# Altium project ECE453-Base.PrjPcb
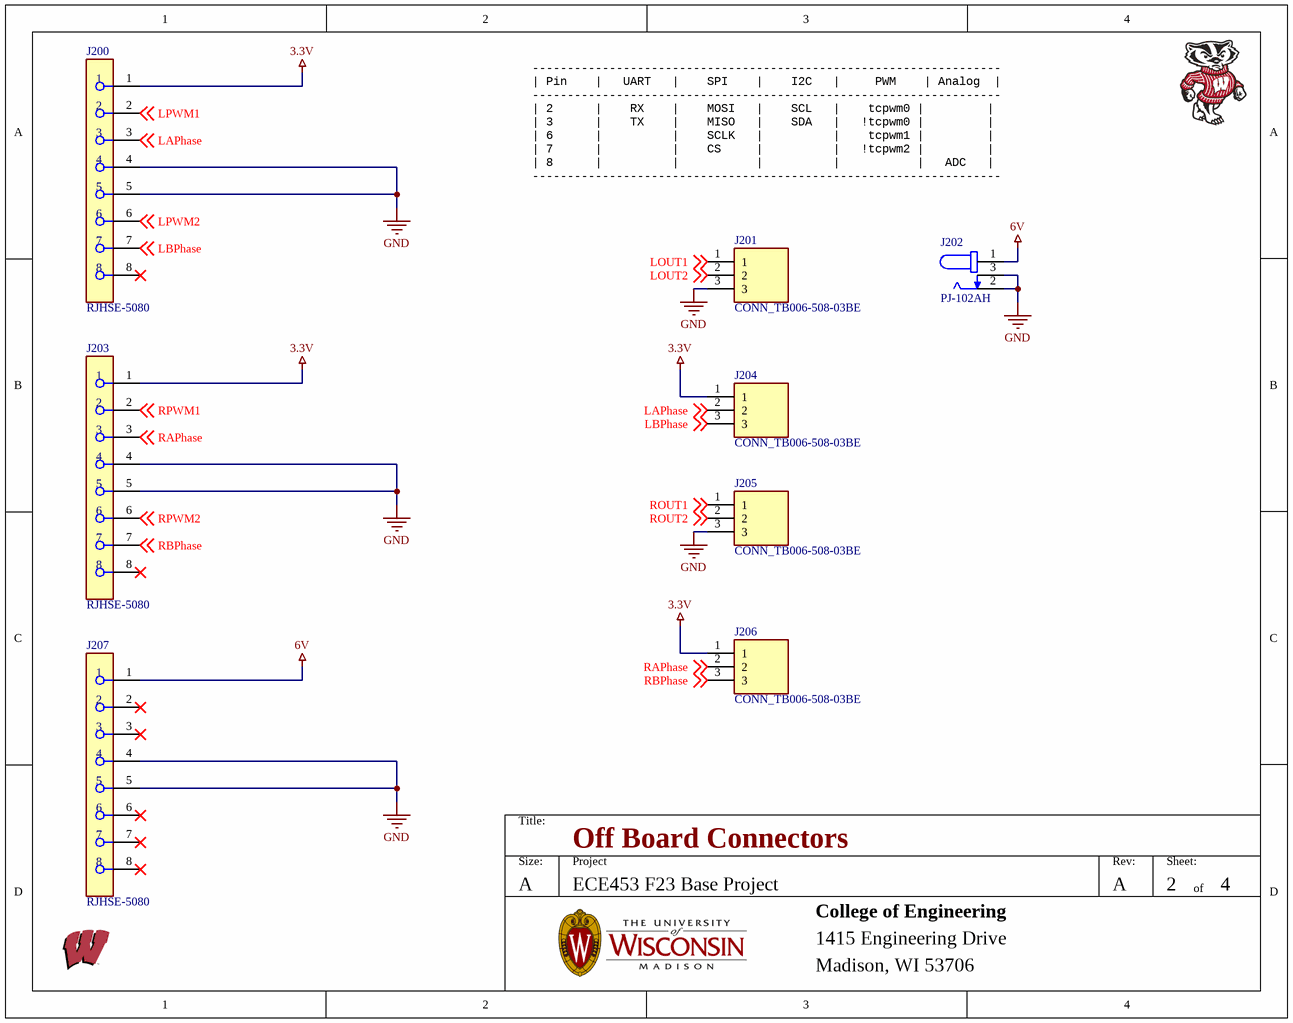
[diagram p0: 02_Connectors.SchDoc]
3 sheets, 38 parts. Net scope: global (net labels, ports and power ports of the same name join across sheets).
Board file: ECE453.PcbDoc
Sheets:
  02_Connectors.SchDoc
  03_ICs.SchDoc
  04_Mechanical.SchDoc

## Sheet 02_Connectors.SchDoc: Off Board Connectors
size A; Revision: A; SheetNumber: 2; SheetTotal: 4; ECE315_Project_Name: ECE453 F23 Base Project

### Parts
J200  RJHSE-5080  [FP-RJHSE-5080-MFG]
J201  CONN_TB006-508-03BE  [CUI_TB006-508-03BE]
J202  PJ-102AH  [CUI_PJ-102AH]
J203  RJHSE-5080  [FP-RJHSE-5080-MFG]
J204  CONN_TB006-508-03BE  [CUI_TB006-508-03BE]
J205  CONN_TB006-508-03BE  [CUI_TB006-508-03BE]
J206  CONN_TB006-508-03BE  [CUI_TB006-508-03BE]
J207  RJHSE-5080  [FP-RJHSE-5080-MFG]

### Nets
3.3V: J200.1 J203.1 J204.1 J206.1
6V: J202.1 J207.1
GND: J200.4 J200.5 J201.3 J202.2 J202.3 J203.4 J203.5 J205.3 J207.4 J207.5
LAPhase: J200.3 J204.2 ; off-sheet LAPhase
LBPhase: J200.7 J204.3 ; off-sheet LBPhase
LOUT1: J201.1 ; off-sheet LOUT1
LOUT2: J201.2 ; off-sheet LOUT2
LPWM1: J200.2 ; off-sheet LPWM1
LPWM2: J200.6 ; off-sheet LPWM2
RAPhase: J203.3 J206.2 ; off-sheet RAPhase
RBPhase: J203.7 J206.3 ; off-sheet RBPhase
ROUT1: J205.1 ; off-sheet ROUT1
ROUT2: J205.2 ; off-sheet ROUT2
RPWM1: J203.2 ; off-sheet RPWM1
RPWM2: J203.6 ; off-sheet RPWM2

Not connected (* = marked no-connect by the designer): J200 8*; J203 8*; J207 2* 3* 6* 7* 8*

### Notes on the sheet
- -------------------------------------------------------------------
  | Pin    |   UART   |    SPI    |    I2C   |     PWM    | Analog  |
  -------------------------------------------------------------------
  | 2      |    RX    |    MOSI   |    SCL   |    tcpwm0 |         |
  | 3      |    TX    |    MISO   |    SDA   |   !tcpwm0 |         |
  | 6      |          |    SCLK   |          |    tcpwm1 |         |
  | 7      |          |    CS     |          |   !tcpwm2 |         |
  | 8      |          |           |          |           |   ADC   |
  -------------------------------------------------------------------
- Title:
- Size:
- A
- Project
- Rev:
- Sheet:
- of
- College of Engineering
- 1415 Engineering Drive
- Madison, WI 53706

### Library data of the parts
J200 J203 J207 = CMP-02366-000003-1: CONN MOD JACK 8P8C R/A UNSHLD; Manufacturer: Amphenol; Current Rating: 1.5A; Voltage Rating: 125V; Pitch: 1.02mm; Conn Orientation: Right Angle; Number Of Contacts: 8; Is Female: yes; Conn Gender: Female; Lead Free: Yes; Device Class L3: unset; Footprint Url: https://cdn.amphenol-icc.com/media/wysiwyg/files/drawing/rjhse5080.pdf?__cf_chl_jschl_tk__=e349db0bbbb6188a39347cd5e541b92fa02c9719-1587748343-0-AW7tChdeHzRPLX9gSWj7WrKaXQoY9BsmT9Ek0h-T62M9y3Rs9iypFcOtkzb-6sGYQEjFE-jcoNciDETCOZrh1rYyOesac5SvYLoLwHIsHvF4AKBlx-MXmfZUVk9OTTJLqyQq2qMm0PFRLJpNcK0nrKResqOniRSYixG2sPTmOPraH-ULJFBDL602CHqcI9KKBgTq90Jh1OL2Td4moJ99rFsJRJ1Tk_uoxGe8ublcP_ARu-uLpWcQrBcwOcHDTAwL29DAwVaqcH7ta8Ks7WMlHmVl_pILeEDwT0bE9vu5Pa5S3PtNRF1leuFkgi_FMbUxTDulc5xzbXSfng8srUIV1lWXny5nx1fZJEUa_w97yKjffzBMxiWLWVN-V7-uqAaPbyv_m-wRyw5O25OZNyJOeGU; ComponentLink2URL: https://cdn.amphenol-icc.com/media/wysiwyg/files/documentation/datasheet/inputoutput/io-modjack-rjhse.pdf; Device Class L1: Connectors; Package: CONN_MOD_JACK; Mouser Description: Modular Connectors / Ethernet Connectors R/A RJ45 NONSHIELDED 8 CONT NO LEDS; Manufacturer Part Number: RJHSE-5080; Octopart: https://octopart.com/rjhse-5080-amphenol-45060; Category: Conn; Height: 0.535inch; Temperature: -55°C to +85°C; Digikey Description: CONN MOD JACK 8P8C R/A UNSHLD; Device Class L2: Modular / Ethernet Connectors; Contact Material: Gold,Nickel; ComponentLink2Description: Datasheet; Temperature Range Low: -55°C; RoHS: TRUE; Automotive: No; Temperature Range High: +85°C
J201 J204-J206 = CONN_TB006-508-03BE: 2~24 Poles, Screw Type, Horizontal, 5.08 Pitch, 26~14 (AWG), Terminal Block Connector; MF: CUI Devices; Price: None; CUI_purchase_URL: https://www.cuidevices.com/product/interconnect/connectors/terminal-blocks/tb006-508-series?utm_source=snapeda.com&utm_medium=referral&utm_campaign=snapedaBOM; Purchase-URL: https://pricing.snapeda.com/search/part/TB006-508-03BE/?ref=eda; MP: TB006-508-03BE; Value: *; Package: None; SnapEDA_Link: https://www.snapeda.com/parts/TB006-508-03BE/CUI+Devices/view-part/?ref=snap; Availability: In Stock; Check_prices: https://www.snapeda.com/parts/TB006-508-03BE/CUI+Devices/view-part/?ref=eda
J202 = CONN_PJ-102AH: 2.0 x 6.5 mm, 5.0 A, Horizontal, Through Hole, Tapered Pins, Dc Power Jack Connector; Manufacturer: CUI; MF: {'manufacturer': u'CUI Devices'}; Number of Conductors: 2; Shielding: Unshielded; Package: None; Price: None; Value: *; MP: PJ-102AH; Availability: Unavailable; Supplier: Digikey; Supplier Part Number: CP-102AH-ND; Manufacturer Part Number: PJ-102AH; RoHS: Yes; Category: Uncategorized; Stock: 76168; Pricing: 1=0.700000, 10=0.590000, 25=0.566000, 40=0.553750, 200=0.529750, 400=0.481600, 600=0.433430, 1000=0.385280, 2400=0.349160 (USD); Orientation: Horizontal; Packaging: Bulk; Termination: Through Hole; Connector Type: Jack; Diameter: 2.1mm; Lead Free: Lead Free; RoHS Compliant: Yes; ComponentLink1URL: http://www.mouser.com/ds/2/670/PJ-102AH-524179.pdf?src-supplier=Mouser; ComponentLink1Description: http://www.mouser.com/ds/2/670/PJ-102AH-524179.pdf?src-supplier=Mouser; ComponentLink2URL: https://www.cui.com/product/resource/digikeypdf/pj-102ah.pdf?src-supplier=Digikey; ComponentLink2Description: https://www.cui.com/product/resource/digikeypdf/pj-102ah.pdf?src-supplier=Digikey; ComponentLink3URL: http://www.cui.com/Product/Resource/FuturePDF/PJ-102AH.pdf?src-supplier=Future+Electronics; ComponentLink3Description: http://www.cui.com/Product/Resource/FuturePDF/PJ-102AH.pdf?src-supplier=Future+Electronics

## Sheet 03_ICs.SchDoc: ICs
size A; Revision: A; SheetNumber: 3; SheetTotal: 4; ECE315_Project_Name: ECE453 F23 Base Project
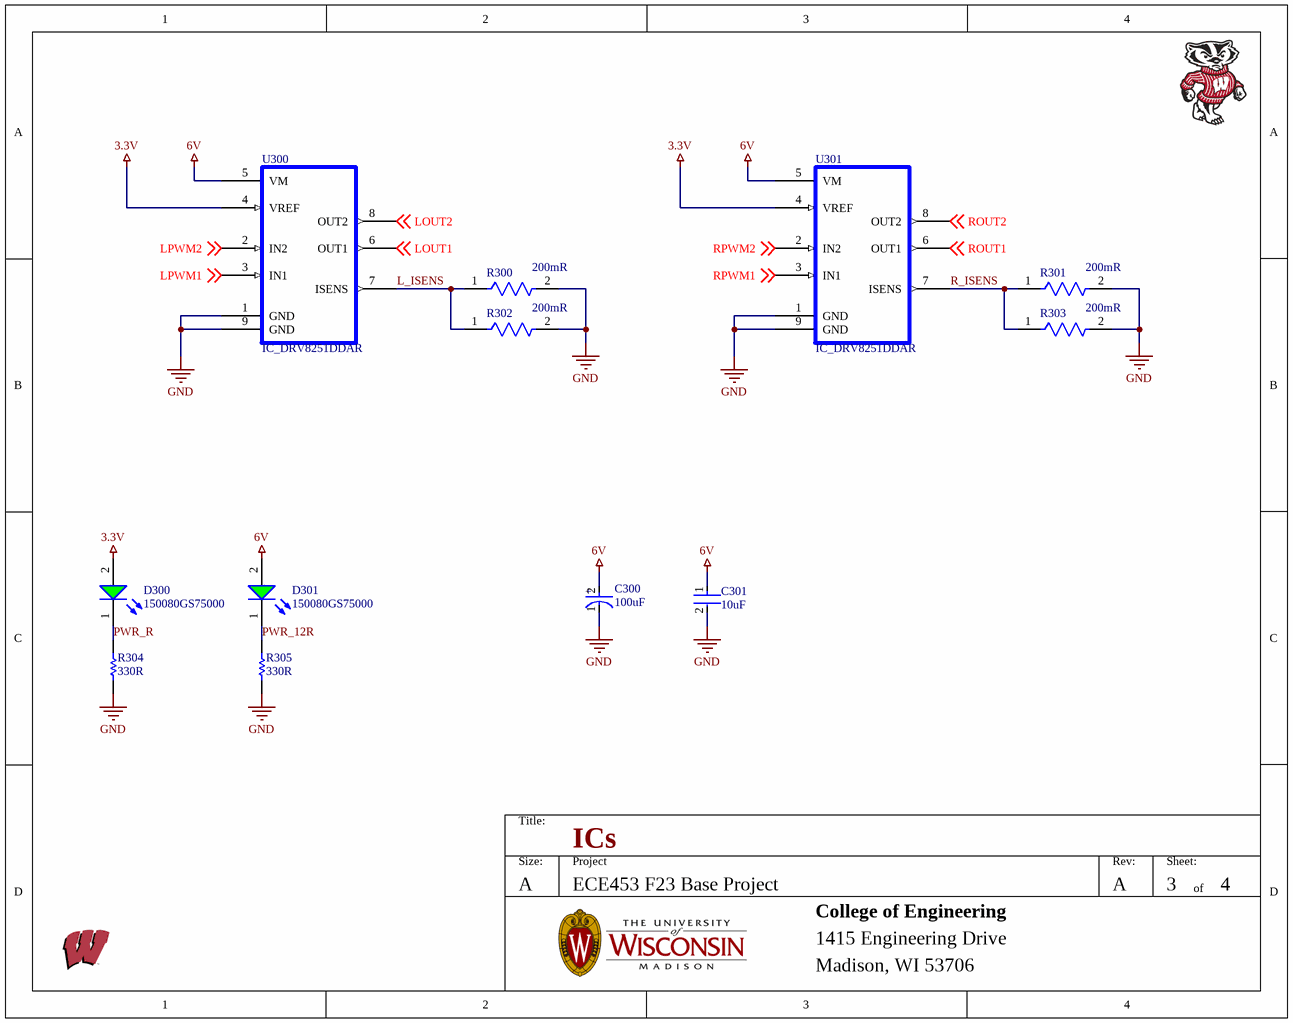
[diagram p1: 03_ICs.SchDoc]

### Parts
C300  100uF  [FP-SD8-MFG]
C301  10uF  [FP-C0805C-DG-MFG]
D300  150080GS75000  [WL-SMCW_0805_150080xx75000]
D301  150080GS75000  [WL-SMCW_0805_150080xx75000]
R300  200mR  [FP-CSR0805-IPC_C]
R301  200mR  [FP-CSR0805-IPC_C]
R302  200mR  [FP-CSR0805-IPC_C]
R303  200mR  [FP-CSR0805-IPC_C]
R304  330R  [RESC2013X60X40LL20T25]
R305  330R  [RESC2013X60X40LL20T25]
U300  IC_DRV8251DDAR  [SOIC_8_PP]
U301  IC_DRV8251DDAR  [SOIC_8_PP]

### Nets
3.3V: D300.2(A) U300.4(VREF) U301.4(VREF)
6V: C300.2(A) C301.1 D301.2(A) U300.5(VM) U301.5(VM)
GND: C300.1(C) C301.2 R300.2 R301.2 R302.2 R303.2 R304.2 R305.2 U300.1(GND) U300.9(GND) U301.1(GND) U301.9(GND)
L_ISENS: R300.1 R302.1 U300.7(ISENS)
LOUT1: U300.6(OUT1) ; off-sheet LOUT1
LOUT2: U300.8(OUT2) ; off-sheet LOUT2
LPWM1: U300.3(IN1) ; off-sheet LPWM1
LPWM2: U300.2(IN2) ; off-sheet LPWM2
PWR_12R: D301.1(K) R305.1
PWR_R: D300.1(K) R304.1
R_ISENS: R301.1 R303.1 U301.7(ISENS)
ROUT1: U301.6(OUT1) ; off-sheet ROUT1
ROUT2: U301.8(OUT2) ; off-sheet ROUT2
RPWM1: U301.3(IN1) ; off-sheet RPWM1
RPWM2: U301.2(IN2) ; off-sheet RPWM2

### Notes on the sheet
- Title:
- Size:
- A
- Project
- Rev:
- Sheet:
- of
- College of Engineering
- 1415 Engineering Drive
- Madison, WI 53706
- (in symbol CMP-05427-000061-1) +

### Library data of the parts
C300 = CMP-05427-000061-1: CAP ALUM 100UF 20% 25V SMD; Manufacturer: Panasonic; Manufacturer Part Number: EEE-1EA101XP; Leakage Current: 3uA; Life (Hours): 2000Hour; Ripple Current: 143mA; Polarity: Polar; Dissipation Factor: 14%; Height - Seated (Max): 0.303inch; Contact Plating: Tin; Max Operating Temperature: 85°C; Package Quantity: 900; RoHS Compliant: Yes; Termination: SMD/SMT; Lead Free: Lead Free; Min Operating Temperature: -40°C; Radiation Hardening: No; Length: 8mm; Height: 7.7mm; Series: S; Voltage Rating: 25V; Capacitance: 100uF; Diameter: 6.3mm; Ripple Current (AC): 143mA; Case/Package: Radial; Packaging: Tape and Reel; Voltage: 25V; Tolerance: 20%; Construction: Cylindrical; Voltage Rating (DC): 25V; Mount: Surface Mount; Supplier: Digikey; Supplier Part Number: PCE3898CT-ND; RoHS: Yes; Category: Aluminum Electrolytic Capacitors; Stock: 37921; Pricing: 1=0.51, 10=0.338, 50=0.2488, 100=0.2025 (USD); Mounting Technology: Surface Mount,PCB; Value: 100uF; Ratings: AEC-Q200; Reach SVHC Compliant: Unknown; ComponentLink1URL: https://datasheet.ciiva.com/30108/11aba0000ce2-30108047.pdf?src-supplier=Onlinecomponents.com; ComponentLink1Description: https://datasheet.ciiva.com/30108/11aba0000ce2-30108047.pdf?src-supplier=Onlinecomponents.com; ComponentLink2URL: https://datasheet.ciiva.com/16201/aba0000ce2-16201065.pdf?src-supplier=Future+Electronics; ComponentLink2Description: https://datasheet.ciiva.com/16201/aba0000ce2-16201065.pdf?src-supplier=Future+Electronics; ComponentLink3URL: https://datasheet.ciiva.com/24022/aba0000ce2-40801-24022875.pdf?src-supplier=Mouser; ComponentLink3Description: https://datasheet.ciiva.com/24022/aba0000ce2-40801-24022875.pdf?src-supplier=Mouser
C301 = CMP-2007-03243-2: CAP CER 10UF 10V X5R 0805; Manufacturer Part Number: C0805C106K8PACTU; Manufacturer: Kemet; 3DS Part Number: 220-00001; Tolerance: 10%; Temperature Coefficient: 15%; Material: Ceramic; Device Class L2: Capacitors; Device Class L1: Passive Components; ComponentLink2URL: https://content.kemet.com/datasheets/KEM_C1006_X5R_SMD.pdf; Height: 1.4mm; Lead Free: Yes; Digikey Description: CAP CER 10UF 10V X5R 0805; Octopart: https://octopart.com/c0805c106k8pactu-kemet-98697; Capacitance: 10uF; Value: 10uF; Temperature Range Low: -55°C; Temperature: -55°C to +85°C; Automotive: No; Mouser Description: CAP CER 10UF 10V X5R 0805; Ipc Land Pattern Name: CAPC200125X125; Temperature Range High: +85°C; Voltage: 10V; RoHS: TRUE; Device Class L3: Ceramic Capacitors; ComponentLink2Description: Datasheet; Voltage Rating: 10V; Package: C0805C-DG; Temperature Characteristic: X5R; Category: Cap; Supplier: Digikey; Supplier Part Number: 399-C0805C106K8PAC7800CT-ND; Stock: 5930250; Pricing: 1=0.14, 10=0.098, 50=0.0584, 100=0.0459, 500=0.03388, 1000=0.02805 (USD); Mounting Technology: Surface Mount; Case/Package: 0805; Pins: 2; Dielectric Material: Ceramic; Contact Plating: Tin,Matte; Case Code (Imperial): 0805; Case Code (Metric): 2012; Min Operating Temperature: -55°C; Max Operating Temperature: 85°C; Packaging: Tape and Reel; Dielectric: X5R; Voltage Rating (DC): 10V; Termination: SMD/SMT; Package Quantity: 1; Dissipation Factor: 10%; Series: C; Construction: Flat; Length: 2mm; Width: 0.049inch; Depth: 1.25mm; Thickness: 0.055inch; Radiation Hardening: No; Reach SVHC Compliant: No; RoHS Compliant: Yes; ComponentLink1URL: https://datasheet.ciiva.com/7842/1732709-7842198.pdf?src-supplier=Element14; ComponentLink1Description: https://datasheet.ciiva.com/7842/1732709-7842198.pdf?src-supplier=Element14; ComponentLink3URL: https://datasheet.ciiva.com/22704/1732709-22704859.pdf?src-supplier=Element14; ComponentLink3Description: https://datasheet.ciiva.com/22704/1732709-22704859.pdf?src-supplier=Element14; ComponentLink4URL: https://datasheet.ciiva.com/7842/40889-7842552.pdf?src-supplier=Element14; ComponentLink4Description: https://datasheet.ciiva.com/7842/40889-7842552.pdf?src-supplier=Element14
D300 D301 = CMP-1426-00007-2: NexarPartId: 29717780; Wavelength: 520nm; Forward Current: 100mA; Lens Style: Clear, Rectangular; Dominant Wavelength: 525nm; Max Junction Temperature (Tj): 95°C; Power Dissipation: 105mW; Luminous Intensity: 450mcd; Peak Wavelength: 515nm; Color: Green; Viewing Angle: 140°; Test Current: 20mA; Reverse Voltage: 5V; Forward Voltage: 3.2V; Mount: Surface Mount; REACH SVHC: Unknown; Min Operating Temperature: -40°C; Case Code (Imperial): 0805; Case/Package: 0805; Max Operating Temperature: 85°C; RoHS: Compliant; Length: 2mm; Height: 700µm; Width: 1.25mm; Case Code (Metric): 2012; Packaging: Tape and Reel; Max Reverse Voltage (DC): 5V
R300-R303 = CMP-26527-002513-1: General Purpose Thick Film Chip Resistor, 0805, 0.2Ω, 1%, 200ppm/°C, 0.25W; Manufacturer: Stackpole Electronics; Manufacturer Part Number: CSR0805FKR200; Max Power Dissipation: 250mW; Height: 0.026inch; Mount: Surface Mount; Temperature Coefficient: 200ppm/°C; Width: 0.049inch; Series: CSR; Number of Terminations: 2; RoHS Compliant: Yes; Case/Package: 0805; Resistance: 200mR; Length: 0.079inch; Max Operating Temperature: 155°C; Packaging: Tape and Reel; Resistor Type: Thick Film; Case Code (Imperial): 0805; Tolerance: 1%; Case Code (Metric): 2012; Min Operating Temperature: -55°C; Supplier: Digikey; Supplier Part Number: CSR0805FKR200CT-ND; RoHS: Yes; Category: Chip SMD Resistors; Stock: 21013; Pricing: 1=0.36, 10=0.265, 25=0.212, 50=0.1576, 100=0.1111, 250=0.09896, 500=0.08484 (USD); Mounting Technology: Surface Mount; Value: 200mR; ComponentLink1URL: https://www.seielect.com/catalog/SEI-Packaging.pdf?src-supplier=Digikey; ComponentLink1Description: https://www.seielect.com/catalog/SEI-Packaging.pdf?src-supplier=Digikey; ComponentLink2URL: https://www.seielect.com/catalog/sei-csr_csrn.pdf?src-supplier=Digikey; ComponentLink2Description: https://www.seielect.com/catalog/sei-csr_csrn.pdf?src-supplier=Digikey
R304 R305 = CMP-2001-00628-1: Manufacturer: Panasonic; Part Number: ERA6AEB331V; Manufacturer Part Number: ERA-6AEB331V; Power Rating: 125mW; Tolerance: 0.1%; Voltage Rating: 100V; Temperature Coefficient: 25ppm/°C; Supplier: Digikey; Supplier Part Number: P330DACT-ND; RoHS: Yes; Category: Chip SMD Resistors; Stock: 18932; Pricing: 1=0.13, 10=0.095, 50=0.0748, 100=0.067, 500=0.05106, 1000=0.04511 (USD); Mounting Technology: Surface Mount; Case/Package: 0805; Pins: 2; Case Code (Imperial): 0805; Case Code (Metric): 2012; Weight: 0.000194oz; Contact Plating: Tin; Min Operating Temperature: -55°C; Max Operating Temperature: 155°C; Value: 330R; Packaging: Tape and Reel; Package Quantity: 1; Resistor Type: Thin Film,Metal Film; Termination: SMD/SMT; Number of Terminations: 2; Max Power Dissipation: 125mW; Voltage Rating (DC): 100V; Features: Automotive AEC-Q200; Series: ERA; Resistance Tolerance: 0.1%; Technology: METAL FILM; Length: 2mm; Width: 1.25mm; Height: 0.5mm; Depth: 1.25mm; Ratings: AEC-Q200; Reach SVHC Compliant: No; Lead Free: Lead Free; RoHS Compliant: Yes; ComponentLink1URL: https://datasheet.ciiva.com/11808/0900766b80eb1d8c-11808093.pdf?src-supplier=Rs; ComponentLink1Description: https://datasheet.ciiva.com/11808/0900766b80eb1d8c-11808093.pdf?src-supplier=Rs; ComponentLink2URL: https://datasheet.ciiva.com/29184/452857-da-01-en-widerstand-0805-era-29184079.pdf?src-supplier=Conrad; ComponentLink2Description: https://datasheet.ciiva.com/29184/452857-da-01-en-widerstand-0805-era-29184079.pdf?src-supplier=Conrad; ComponentLink3URL: https://datasheet.ciiva.com/9182/aoa0000ce26-9182968.pdf?src-supplier=Avnet; ComponentLink3Description: https://datasheet.ciiva.com/9182/aoa0000ce26-9182968.pdf?src-supplier=Avnet; ComponentLink4URL: https://datasheet.ciiva.com/48536/era-eng-tds-48536857.pdf?src-supplier=Distrelec; ComponentLink4Description: https://datasheet.ciiva.com/48536/era-eng-tds-48536857.pdf?src-supplier=Distrelec; ComponentLink5URL: https://datasheet.ciiva.com/22759/485442-22759176.pdf?src-supplier=Farnell; ComponentLink5Description: https://datasheet.ciiva.com/22759/485442-22759176.pdf?src-supplier=Farnell; ComponentLink6URL: https://datasheet.ciiva.com/6138/485442-6138589.pdf?src-supplier=Farnell; ComponentLink6Description: https://datasheet.ciiva.com/6138/485442-6138589.pdf?src-supplier=Farnell; ComponentLink7URL: https://datasheet.ciiva.com/43457/485442-43457816.pdf?src-supplier=Farnell; ComponentLink7Description: https://datasheet.ciiva.com/43457/485442-43457816.pdf?src-supplier=Farnell; ComponentLink8URL: https://datasheet.ciiva.com/6138/485442-6138585.pdf?src-supplier=Farnell; ComponentLink8Description: https://datasheet.ciiva.com/6138/485442-6138585.pdf?src-supplier=Farnell; ComponentLink9URL: https://datasheet.ciiva.com/24164/aoa0000ce26-197354-24164407.pdf?src-supplier=Mouser; ComponentLink9Description: https://datasheet.ciiva.com/24164/aoa0000ce26-197354-24164407.pdf?src-supplier=Mouser; ComponentLink10URL: https://datasheet.ciiva.com/22744/1776116-22744153.pdf?src-supplier=Element14; ComponentLink10Description: https://datasheet.ciiva.com/22744/1776116-22744153.pdf?src-supplier=Element14
U300 U301 = IC_DRV8251DDAR: 48-V, 3.5-A H bridge motor driver with current regulation and latched OCP 8-SO PowerPAD -40 to 150; Manufacturer: Texas Instruments; Supplier: Digi-Key; Supplier Part Number: 296-DRV8251DDARCT-ND; Manufacturer Part Number: DRV8251DDAR; RoHS: No; Category: Integrated Circuits (ICs); Stock: 4730; Pricing: 1=1.66, 10=1.495, 25=1.4108, 100=1.202, 250=1.12868, 500=0.9876, 1000=0.81829 (USD)

## Sheet 04_Mechanical.SchDoc: Mechanicals
size A; Revision: A; SheetNumber: 4; SheetTotal: 4; ECE315_Project_Name: ECE453 Base Project
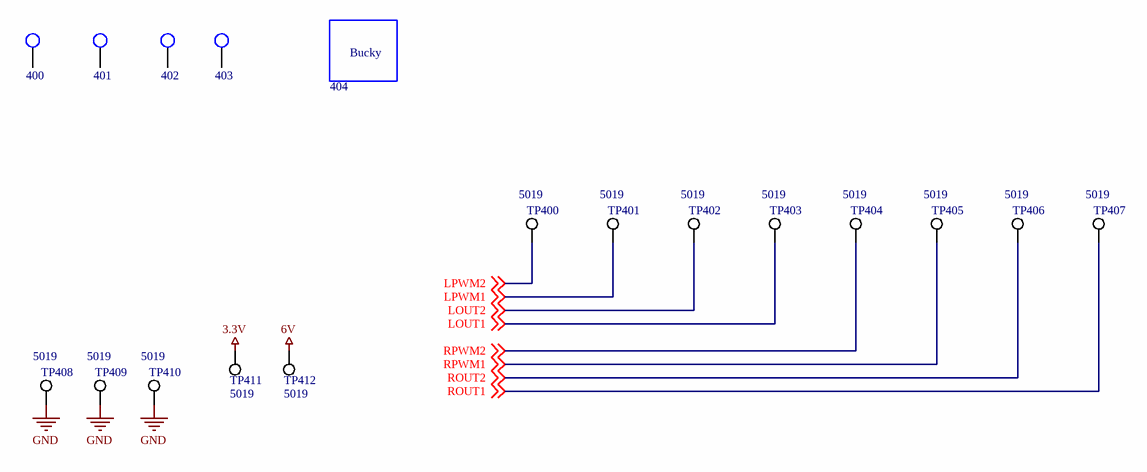
[diagram p2: 04_Mechanical.SchDoc]

### Parts
400  MHOLE_2_55MM  [MHOLE_2_55MM]  (value not drawn)
401  MHOLE_2_55MM  [MHOLE_2_55MM]  (value not drawn)
402  MHOLE_2_55MM  [MHOLE_2_55MM]  (value not drawn)
403  MHOLE_2_55MM  [MHOLE_2_55MM]  (value not drawn)
404  Bucky  [WalkingBucky]  (value not drawn)  (no BOM)
TP400  5019  [KSTN-5019_V]
TP401  5019  [KSTN-5019_V]
TP402  5019  [KSTN-5019_V]
TP403  5019  [KSTN-5019_V]
TP404  5019  [KSTN-5019_V]
TP405  5019  [KSTN-5019_V]
TP406  5019  [KSTN-5019_V]
TP407  5019  [KSTN-5019_V]
TP408  5019  [KSTN-5019_V]
TP409  5019  [KSTN-5019_V]
TP410  5019  [KSTN-5019_V]
TP411  5019  [KSTN-5019_V]
TP412  5019  [KSTN-5019_V]

### Nets
3.3V: TP411.1
6V: TP412.1
GND: TP408.1 TP409.1 TP410.1
LOUT1: TP403.1 ; off-sheet LOUT1
LOUT2: TP402.1 ; off-sheet LOUT2
LPWM1: TP401.1 ; off-sheet LPWM1
LPWM2: TP400.1 ; off-sheet LPWM2
ROUT1: TP407.1 ; off-sheet ROUT1
ROUT2: TP406.1 ; off-sheet ROUT2
RPWM1: TP405.1 ; off-sheet RPWM1
RPWM2: TP404.1 ; off-sheet RPWM2

Not connected (* = marked no-connect by the designer): 400 1; 401 1; 402 1; 403 1

### Notes on the sheet
- Title:
- Size:
- A
- Project
- Rev:
- Sheet:
- of
- College of Engineering
- 1415 Engineering Drive
- Madison, WI 53706

### Library data of the parts
400-403 = MHOLE_2_55MM: Mounting Holde; Manufacturer Part Number: UW MTHOLE
404 = Bucky: Bucky Badger Image; Manufacturer Part Number: UW Bucky
TP400-TP412 = CMP-1672-00008-1: Test Point, 1 Position SMD, RoHS, Tape and Reel; ComponentLink1Description: Manufacturer URL; Package Quantity: 1000; DatasheetVersion: 03/2014; Packaging: Tape and Reel; ComponentLink2URL: http://www.keyelco.com/product-pdf.cfm?p=1357; ComponentLink1URL: http://www.keyelco.com/; Mount: Surface Mount; Contact Plating: Silver; PackageDescription: 1-Pin Surface Mount Device, Body 3.81 x 2.03 mm; Pins: 1; RoHSCompliant: True; Mounting Technology: Surface Mount; ComponentLink2Description: Datasheet; PackageReference: 5019; Supplier: Digikey; Supplier Part Number: 36-5019DKR-ND

## Nets that join several sheets
3.3V: 02_Connectors (J200.1 J203.1 J204.1 J206.1), 03_ICs (D300.2 U300.4 U301.4), 04_Mechanical (TP411.1)
6V: 02_Connectors (J202.1 J207.1), 03_ICs (5 pins), 04_Mechanical (TP412.1)
GND: 02_Connectors (10 pins), 03_ICs (12 pins), 04_Mechanical (TP408.1 TP409.1 TP410.1)
LOUT1: 02_Connectors (J201.1), 03_ICs (U300.6), 04_Mechanical (TP403.1)
LOUT2: 02_Connectors (J201.2), 03_ICs (U300.8), 04_Mechanical (TP402.1)
LPWM1: 02_Connectors (J200.2), 03_ICs (U300.3), 04_Mechanical (TP401.1)
LPWM2: 02_Connectors (J200.6), 03_ICs (U300.2), 04_Mechanical (TP400.1)
ROUT1: 02_Connectors (J205.1), 03_ICs (U301.6), 04_Mechanical (TP407.1)
ROUT2: 02_Connectors (J205.2), 03_ICs (U301.8), 04_Mechanical (TP406.1)
RPWM1: 02_Connectors (J203.2), 03_ICs (U301.3), 04_Mechanical (TP405.1)
RPWM2: 02_Connectors (J203.6), 03_ICs (U301.2), 04_Mechanical (TP404.1)